# Altium project VCU.PrjPcb (part 2 of 2)

## Sheet 24V_Load_Switches.SchDoc
size A3; SheetNumber: 10; SheetTotal: 17
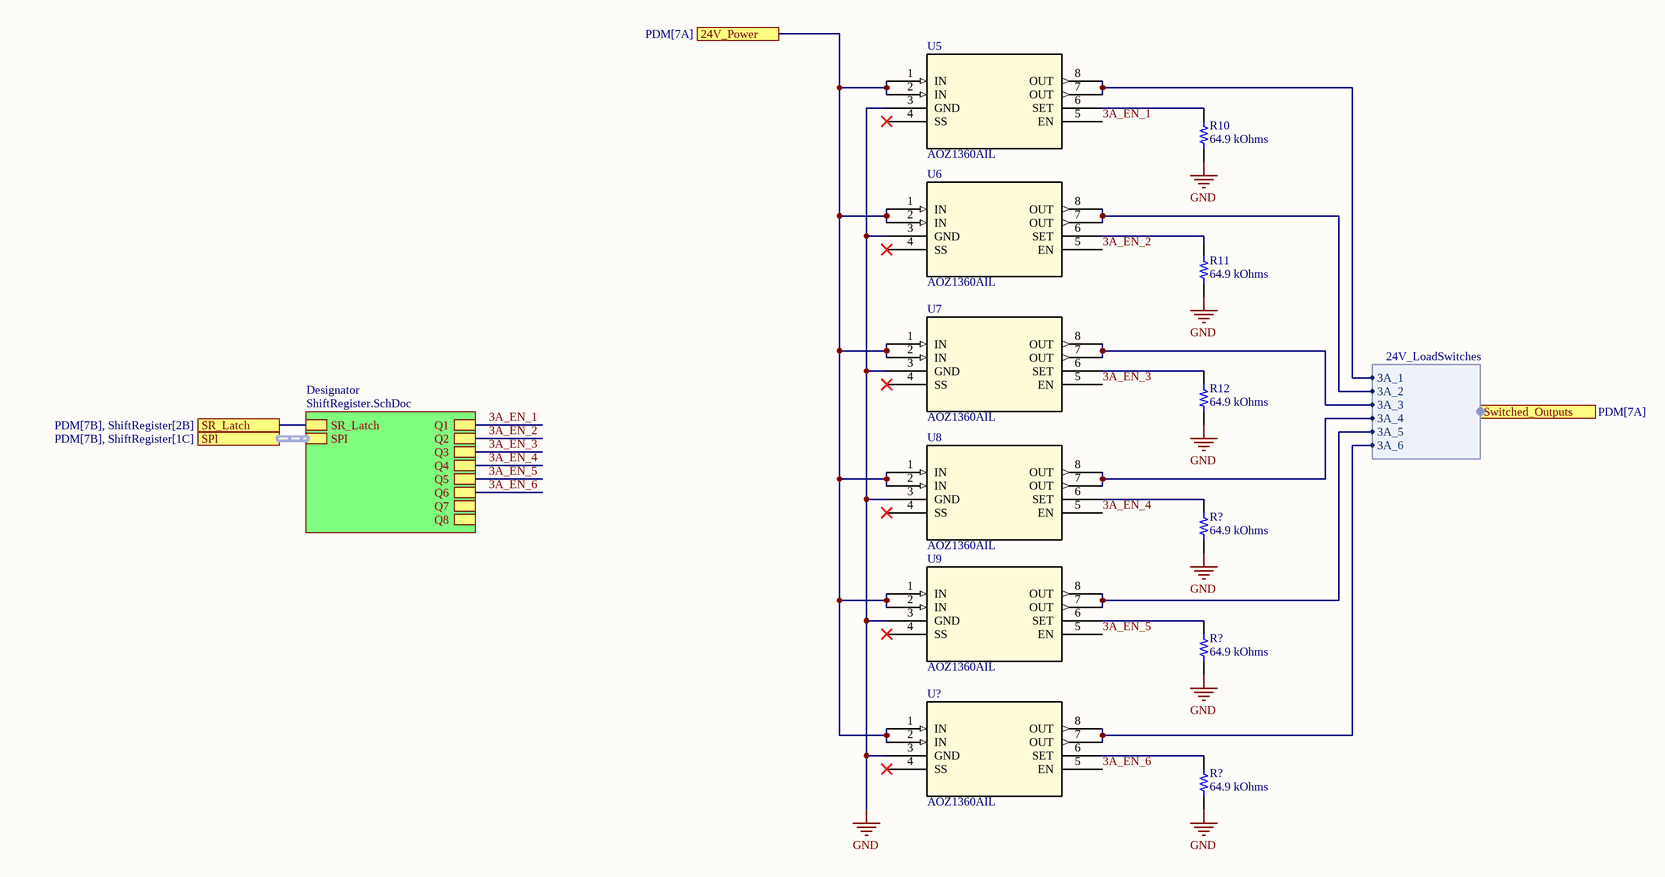
[diagram p8: 24V_Load_Switches.SchDoc]

### Parts
(Parts that share a designator on the sheet are numbered #1, #2 ... from top to bottom, then left to right.)
R10  64.9 kOhms  [RES 0603_1608]
R11  64.9 kOhms  [RES 0603_1608]
R12  64.9 kOhms  [RES 0603_1608]
R?#1  64.9 kOhms  [RES 0603_1608]
R?#2  64.9 kOhms  [RES 0603_1608]
R?#3  64.9 kOhms  [RES 0603_1608]
U5  AOZ1360AIL  [AOZ1360AIL_AOS]
U6  AOZ1360AIL  [AOZ1360AIL_AOS]
U7  AOZ1360AIL  [AOZ1360AIL_AOS]
U8  AOZ1360AIL  [AOZ1360AIL_AOS]
U9  AOZ1360AIL  [AOZ1360AIL_AOS]
U?#2  AOZ1360AIL  [AOZ1360AIL_AOS]

### Sub-sheets
Designator = ShiftRegister.SchDoc: SPI (harness SPI), SR_Latch, Q1, Q2, Q3, Q4, Q5, Q6, Q8, Q7

### Ports
24V_Power (see PDM[7A]), SPI (harness SPI, see PDM[7B], ShiftRegister[1C]), SR_Latch (see PDM[7B], ShiftRegister[2B]), Switched_Outputs (harness 24V_LoadSwitches, see PDM[7A])

### Harnesses
24V_LoadSwitches: 3A_1, 3A_2, 3A_3, 3A_4, 3A_5, 3A_6

### Nets
GND: R10.1 R11.1 R12.1 R?#1.1 R?#2.1 R?#3.1 U5.3(GND) U6.3(GND) U7.3(GND) U8.3(GND) U9.3(GND) U?#2.3(GND)
3A_EN_1: U5.5(EN) ; sheet Designator/Q1
3A_EN_2: U6.5(EN) ; sheet Designator/Q2
3A_EN_3: U7.5(EN) ; sheet Designator/Q3
3A_EN_4: U8.5(EN) ; sheet Designator/Q4
3A_EN_5: U9.5(EN) ; sheet Designator/Q5
3A_EN_6: U?#2.5(EN) ; sheet Designator/Q6
24V_3A_1: U5.7(OUT) U5.8(OUT) ; port Switched_Outputs.3A_1
24V_3A_2: U6.7(OUT) U6.8(OUT) ; port Switched_Outputs.3A_2
24V_3A_3: U7.7(OUT) U7.8(OUT) ; port Switched_Outputs.3A_3
24V_3A_4: U8.7(OUT) U8.8(OUT) ; port Switched_Outputs.3A_4
24V_3A_5: U9.7(OUT) U9.8(OUT) ; port Switched_Outputs.3A_5
24V_3A_6: U?#2.7(OUT) U?#2.8(OUT) ; port Switched_Outputs.3A_6
NetIC1_81: port SR_Latch, sheet Designator/SR_Latch
NetR10_2: R10.2 U5.6(SET)
NetR11_2: R11.2 U6.6(SET)
NetR12_2: R12.2 U7.6(SET)
NetR24_1: U5.1(IN) U5.2(IN) U6.1(IN) U6.2(IN) U7.1(IN) U7.2(IN) U8.1(IN) U8.2(IN) U9.1(IN) U9.2(IN) U?#2.1(IN) U?#2.2(IN) ; port 24V_Power
NetR?#1_2: R?#1.2 U8.6(SET)
NetR?#2_2: R?#2.2 U9.6(SET)
NetR?#3_2: R?#3.2 U?#2.6(SET)

Not connected (* = marked no-connect by the designer): U5 4(SS)*; U6 4(SS)*; U7 4(SS)*; U8 4(SS)*; U9 4(SS)*; U?#2 4(SS)*

### Buses and harness runs
harness port SPI = sheet Designator/SPI

### Library data of the parts
R10-R12 R?#1-R?#3 = 7-2176089-3: RES SMD 64.9K OHM 0.1% 1/6W 0603; Manufacturer: TE Connectivity Passive Product; Power (Watts): 0.167W, 1/6W; Temperature Coefficient: ±25ppm/°C; Part Number: 7-2176089-3; Value: 64.9 kOhms; ComponentLink1Description: Datasheet; ComponentLink1URL: https://www.te.com/commerce/DocumentDelivery/DDEController?Action=srchrtrv&DocNm=1773272&DocType=DS&DocLang=English; ComponentLink2Description: DigiKey Link; ComponentLink2URL: https://www.digikey.com/en/products/detail/te-connectivity-passive-product/7-2176089-3/4033750; Composition: Thin Film; Device Package: 0603 (1608 Metric); Height - Seated (Max): 0.022" (0.55mm); LastUpdated: 12/19/2023 8:39:23 PM; Lifecycle Status: Active; Minimum Order: 1; Number of Terminations: 2; Operating Temperature: -55°C ~ 155°C; Package / Case: 0603 (1608 Metric); Packaging: TapeAndReel; PartId: 23912; Part Status: Active; Price: 0.14; Resistance: 64.9 kOhms; Series: RP73P, Holsworthy; Size / Dimension: 0.061" L x 0.031" W (1.55mm x 0.80mm); Supplier 1: DigiKey; Supplier Part Number 1: A110282CT-ND; Supplier Device Package: 0603; Tolerance: ±0.1%
U5-U9 U?#2 = AOZ1360AIL: No Description Available; Mfr_Name: Alpha and Omega Semiconductor; Copyright: Copyright (C) 2023 Ultra Librarian. All rights reserved.; Manufacturer_Part_Number: AOZ1360AIL; RefDes: RefDes; Type: DEV

## Sheet ShiftRegister.SchDoc
size A4; SheetNumber: 10; SheetTotal: 10
Used 3 times, as channels Power Distribution Manager/24V Load Switches/Designator, Power Distribution Manager/Designator/Designator, Power Distribution Manager/Designator/Designator. Parts and nets are listed once, with the designators drawn on the sheet.
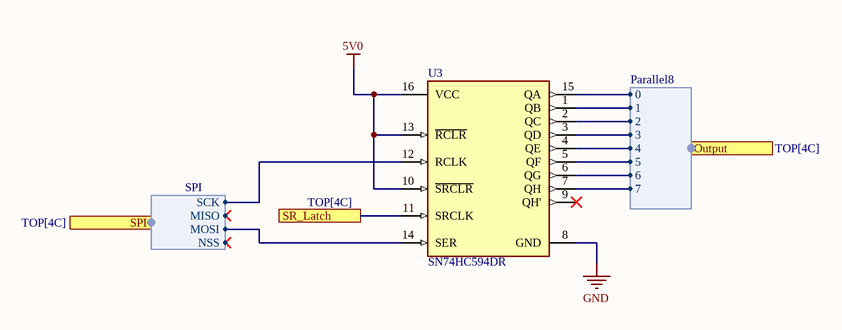
[diagram p9: ShiftRegister.SchDoc]

### Parts
U3  SN74HC594DR  [FP-D0016A-IPC_A]

### Ports
Output (harness Parallel8, see TOP[4C]), SPI (harness SPI, see TOP[4C]), SR_Latch (see TOP[4C])

### Harnesses
SPI: NSS, SCK, MISO, MOSI
Parallel8: 0, 1, 2, 3, 4, 5, 6, 7

### Nets
5V0: U3.10(~{SRCLR}) U3.13(~{RCLR}) U3.16(VCC)
GND: U3.8(GND)
SR_Latch: U3.11(SRCLK) ; port SR_Latch
NetU3_1: U3.1(QB) ; port Output.1
NetU3_2: U3.2(QC) ; port Output.2
NetU3_3: U3.3(QD) ; port Output.3
NetU3_4: U3.4(QE) ; port Output.4
NetU3_5: U3.5(QF) ; port Output.5
NetU3_6: U3.6(QG) ; port Output.6
NetU3_7: U3.7(QH) ; port Output.7
NetU3_12: U3.12(RCLK) ; port SPI.SCK
NetU3_14: U3.14(SER) ; port SPI.MOSI
NetU3_15: U3.15(QA) ; port Output.0

Not connected (* = marked no-connect by the designer): U3 9(QH')*

### Channels
Power Distribution Manager/24V Load Switches/Designator: designators end in _Power_Distribution_Manager_24V_Load_Switches_Designator; ports SR_Latch=NetIC1_81
Power Distribution Manager/Designator/Designator: designators end in _Power_Distribution_Manager_Designator_Designator#1; ports SR_Latch=NetIC1_82
Power Distribution Manager/Designator/Designator: designators end in _Power_Distribution_Manager_Designator_Designator#2; ports SR_Latch=NetU3_Power_Distribution_Manager_Designator_Designator#2_11

### Library data of the parts
U3 = CMP-0780-00061-4: IC SHIFT REGISTER 8BIT 16-SOIC; Number of Bits per Element: 8; Min Supply Voltage: 2V; Frequency: 40MHz; Max Supply Voltage: 6V; Operating Supply Voltage: 5V; Number of Output Lines: 10; Propagation Delay: 25ns; Number of Elements: 1; Number of Circuits: 4; Direction: Unidirectional; Turn-On Delay Time: 185ns; RoHS Compliant: Yes; Width: 3.91mm; Length: 9.9mm; Min Operating Temperature: -40°C; Max Operating Temperature: 125°C; Package Quantity: 2500; Series: 74HC; Height: 1.58mm; Number of Bits: 8; Mount: Surface Mount; Logic Function: Shift Register; Radiation Hardening: No; Number of Pins: 16; Technology: CMOS; Packaging: Tape and Reel; Lead Free: Lead Free; Weight: 0.004998oz; REACH SVHC: No SVHC; Case/Package: SOIC

## Sheet 12V_Load_Switches.SchDoc
size A3; SheetNumber: 16; SheetTotal: 17
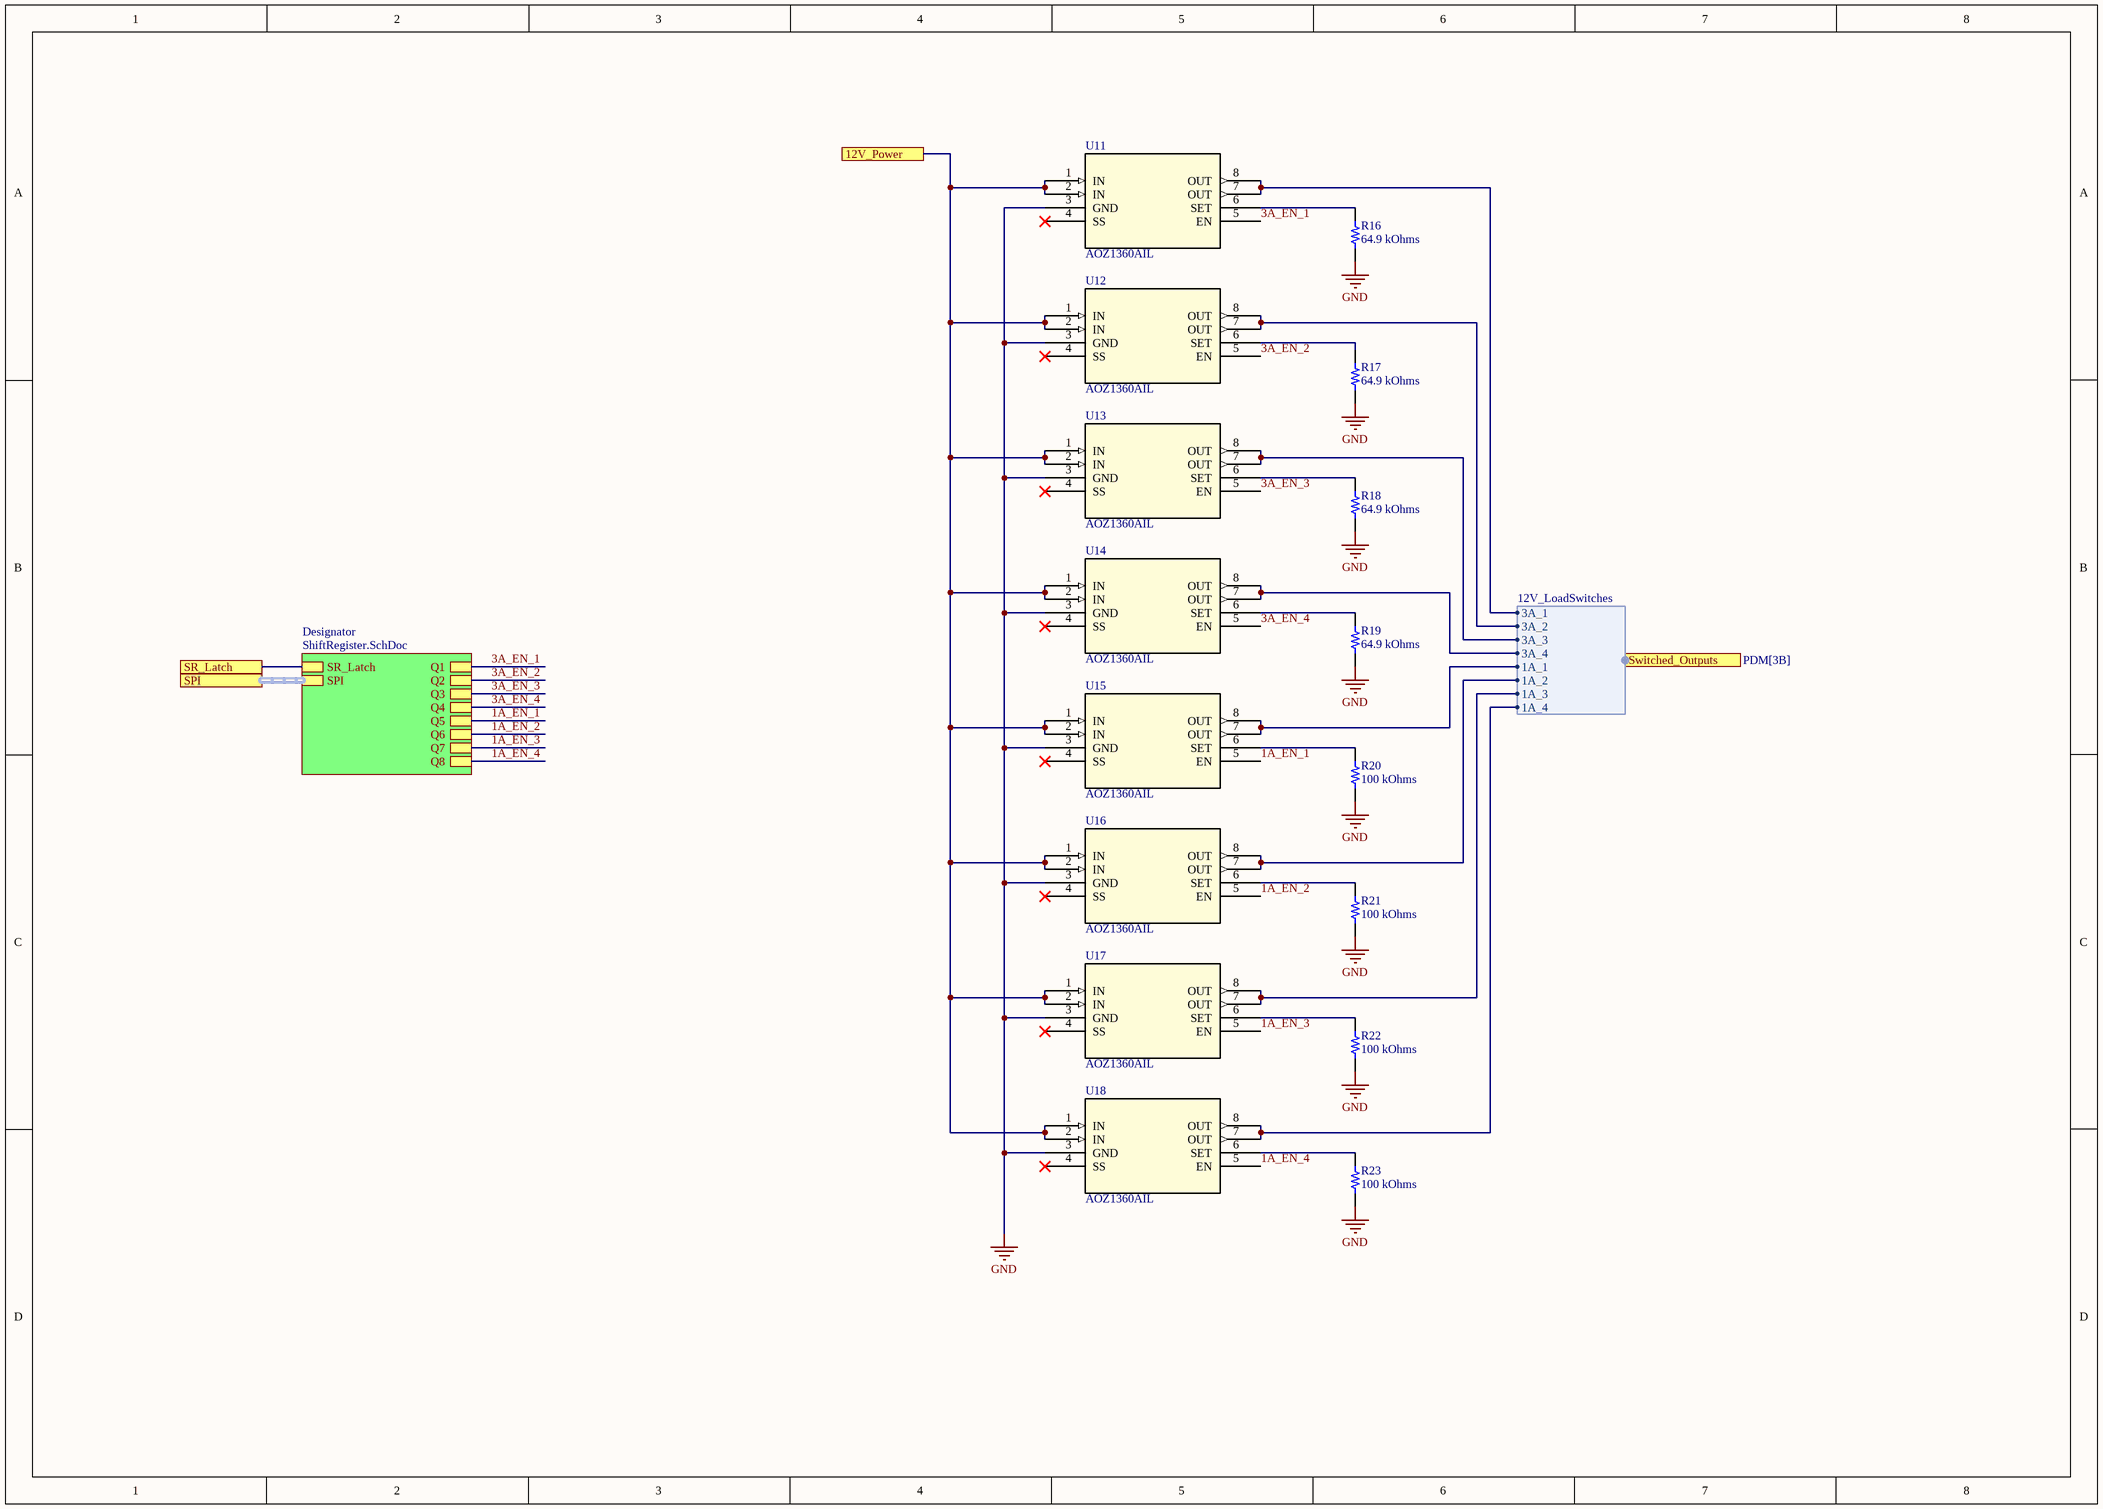
[diagram p10: 12V_Load_Switches.SchDoc]

### Parts
R16  64.9 kOhms  [RES 0603_1608]
R17  64.9 kOhms  [RES 0603_1608]
R18  64.9 kOhms  [RES 0603_1608]
R19  64.9 kOhms  [RES 0603_1608]
R20  100 kOhms  [RES 0603_1608]
R21  100 kOhms  [RES 0603_1608]
R22  100 kOhms  [RES 0603_1608]
R23  100 kOhms  [RES 0603_1608]
U11  AOZ1360AIL  [AOZ1360AIL_AOS]
U12  AOZ1360AIL  [AOZ1360AIL_AOS]
U13  AOZ1360AIL  [AOZ1360AIL_AOS]
U14  AOZ1360AIL  [AOZ1360AIL_AOS]
U15  AOZ1360AIL  [AOZ1360AIL_AOS]
U16  AOZ1360AIL  [AOZ1360AIL_AOS]
U17  AOZ1360AIL  [AOZ1360AIL_AOS]
U18  AOZ1360AIL  [AOZ1360AIL_AOS]

### Sub-sheets
Designator = ShiftRegister.SchDoc: SPI (harness SPI), SR_Latch, Q1, Q2, Q3, Q4, Q5, Q6, Q8, Q7

### Ports
12V_Power, SPI (harness SPI), SR_Latch, Switched_Outputs (harness 12V_LoadSwitches, see PDM[3B])

### Harnesses
12V_LoadSwitches: 3A_1, 3A_2, 3A_3, 3A_4, 1A_1, 1A_2, 1A_3, 1A_4

### Nets
GND: R16.1 R17.1 R18.1 R19.1 R20.1 R21.1 R22.1 R23.1 U11.3(GND) U12.3(GND) U13.3(GND) U14.3(GND) U15.3(GND) U16.3(GND) U17.3(GND) U18.3(GND)
1A_EN_1: U15.5(EN) ; sheet Designator/Q5
1A_EN_2: U16.5(EN) ; sheet Designator/Q6
1A_EN_3: U17.5(EN) ; sheet Designator/Q7
1A_EN_4: U18.5(EN) ; sheet Designator/Q8
3A_EN_1: U11.5(EN) ; sheet Designator/Q1
3A_EN_2: U12.5(EN) ; sheet Designator/Q2
3A_EN_3: U13.5(EN) ; sheet Designator/Q3
3A_EN_4: U14.5(EN) ; sheet Designator/Q4
12V_1A_1: U15.7(OUT) U15.8(OUT) ; port Switched_Outputs.1A_1
12V_1A_2: U16.7(OUT) U16.8(OUT) ; port Switched_Outputs.1A_2
12V_1A_3: U17.7(OUT) U17.8(OUT) ; port Switched_Outputs.1A_3
12V_1A_4: U18.7(OUT) U18.8(OUT) ; port Switched_Outputs.1A_4
12V_3A_1: U11.7(OUT) U11.8(OUT) ; port Switched_Outputs.3A_1
12V_3A_2: U12.7(OUT) U12.8(OUT) ; port Switched_Outputs.3A_2
12V_3A_3: U13.7(OUT) U13.8(OUT) ; port Switched_Outputs.3A_3
12V_3A_4: U14.7(OUT) U14.8(OUT) ; port Switched_Outputs.3A_4
NetIC1_82: port SR_Latch, sheet Designator/SR_Latch
NetR16_2: R16.2 U11.6(SET)
NetR17_2: R17.2 U12.6(SET)
NetR18_2: R18.2 U13.6(SET)
NetR19_2: R19.2 U14.6(SET)
NetR20_2: R20.2 U15.6(SET)
NetR21_2: R21.2 U16.6(SET)
NetR22_2: R22.2 U17.6(SET)
NetR23_2: R23.2 U18.6(SET)
NetR26_1: U11.1(IN) U11.2(IN) U12.1(IN) U12.2(IN) U13.1(IN) U13.2(IN) U14.1(IN) U14.2(IN) U15.1(IN) U15.2(IN) U16.1(IN) U16.2(IN) U17.1(IN) U17.2(IN) U18.1(IN) U18.2(IN) ; port 12V_Power

Not connected (* = marked no-connect by the designer): U11 4(SS)*; U12 4(SS)*; U13 4(SS)*; U14 4(SS)*; U15 4(SS)*; U16 4(SS)*; U17 4(SS)*; U18 4(SS)*

### Buses and harness runs
harness port SPI = sheet Designator/SPI

### Library data of the parts
R16-R19 = 7-2176089-3: as R10 on sheet 24V_Load_Switches; Part Number: 7-2176089-3; Value: 64.9 kOhms; ComponentLink1Description: Datasheet; ComponentLink1URL: https://www.te.com/commerce/DocumentDelivery/DDEController?Action=srchrtrv&DocNm=1773272&DocType=DS&DocLang=English; ComponentLink2Description: DigiKey Link; ComponentLink2URL: https://www.digikey.com/en/products/detail/te-connectivity-passive-product/7-2176089-3/4033750; Composition: Thin Film; Device Package: 0603 (1608 Metric); Height - Seated (Max): 0.022" (0.55mm); LastUpdated: 12/19/2023 8:39:23 PM; Lifecycle Status: Active; Minimum Order: 1; Number of Terminations: 2; Operating Temperature: -55°C ~ 155°C; Package / Case: 0603 (1608 Metric); Packaging: TapeAndReel; PartId: 23912; Part Status: Active; Price: 0.14; Resistance: 64.9 kOhms; Series: RP73P, Holsworthy; Size / Dimension: 0.061" L x 0.031" W (1.55mm x 0.80mm); Supplier 1: DigiKey; Supplier Part Number 1: A110282CT-ND; Supplier Device Package: 0603; Tolerance: ±0.1%
R20-R23 = AA0603FR-07100KL: RES SMD 100K OHM 1% 1/10W 0603; Manufacturer: Yageo; Power (Watts): 0.1W, 1/10W; Temperature Coefficient: ±150ppm/°C; Part Number: AA0603FR-07100KL; Value: 100 kOhms; ComponentLink1Description: Datasheet; ComponentLink1URL: https://www.yageo.com/upload/media/product/productsearch/datasheet/rchip/PYu-AA_51_RoHS_L_3.pdf; ComponentLink2Description: DigiKey Link; ComponentLink2URL: https://www.digikey.com/en/products/detail/yageo/AA0603FR-07100KL/5888687; Composition: Thick Film; Device Package: 0603 (1608 Metric); Features: Anti-Sulfur, Automotive AEC-Q200, Moisture Resistant; Height - Seated (Max): 0.022" (0.55mm); LastUpdated: 12/20/2023 8:36:28 PM; Lifecycle Status: Active; Minimum Order: 1; Number of Terminations: 2; Operating Temperature: -55°C ~ 155°C; Package / Case: 0603 (1608 Metric); Packaging: TapeAndReel; PartId: 78895; Price: 0.01; Ratings: AEC-Q200; Resistance: 100 kOhms; Series: AA; Size / Dimension: 0.063" L x 0.031" W (1.60mm x 0.80mm); Supplier 1: DigiKey; Supplier Part Number 1: 13-AA0603FR-07100KLCT-ND; Supplier Device Package: 0603; Tolerance: ±1%
U11-U18 = AOZ1360AIL: as U5 on sheet 24V_Load_Switches; Copyright: Copyright (C) 2023 Ultra Librarian. All rights reserved.; Manufacturer_Part_Number: AOZ1360AIL; RefDes: RefDes; Type: DEV

## Sheet 5V_Load_Switches.SchDoc
size A4; SheetNumber: 14; SheetTotal: 18
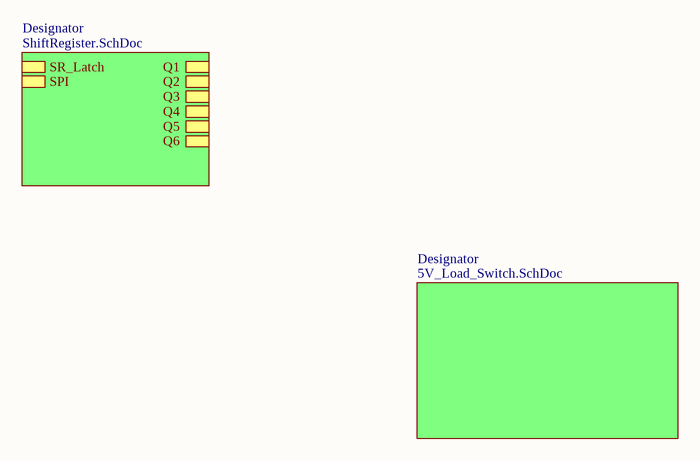
[diagram p11: 5V_Load_Switches.SchDoc]

### Sub-sheets
Designator = ShiftRegister.SchDoc: SPI (harness SPI), SR_Latch, Q1, Q2, Q3, Q4, Q5, Q6
Designator = 5V_Load_Switch.SchDoc (file not in this document): no entries

## Sheet 24V_FETS.SchDoc
size A4; SheetNumber: 12; SheetTotal: 14
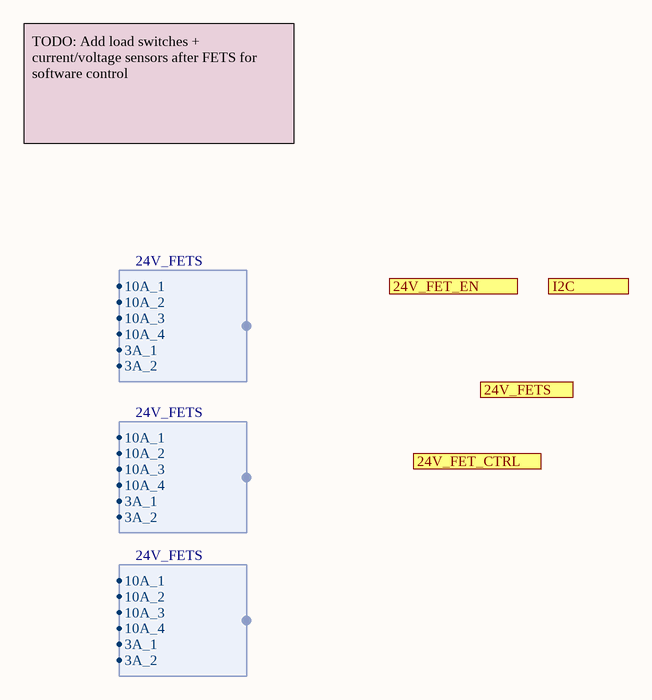
[diagram p12: 24V_FETS.SchDoc]

### Ports
24V_FET_CTRL (harness 24V_FETS), 24V_FET_EN (harness 24V_FETS), 24V_FETS (harness 24V_FETS), I2C (harness I2C)

### Harnesses
24V_FETS: 10A_1, 10A_2, 10A_3, 10A_4, 3A_1, 3A_2

### Notes on the sheet
- TODO: Add load switches + current/voltage sensors after FETS for software control

## Nets that join several sheets
5V0: Power Distribution Manager/24V Load Switches/Designator (U3_Power_Distribution_Manager_24V_Load_Switches_Designator.10 U3_Power_Distribution_Manager_24V_Load_Switches_Designator.13 U3_Power_Distribution_Manager_24V_Load_Switches_Designator.16), Power Distribution Manager/Designator/Designator (U3_Power_Distribution_Manager_Designator_Designator#1.10 U3_Power_Distribution_Manager_Designator_Designator#1.13 U3_Power_Distribution_Manager_Designator_Designator#1.16), Power Distribution Manager/Designator/Designator (U3_Power_Distribution_Manager_Designator_Designator#2.10 U3_Power_Distribution_Manager_Designator_Designator#2.13 U3_Power_Distribution_Manager_Designator_Designator#2.16)
5VCC: MCU (U?#1.3), IO (J22.1 J28.1)
GND: TOP (7 pins), MCU (26 pins), CAN (R4.1 R5.1 U1.2 U2.2), IO (42 pins), AnalogIO (10 pins), Ports/Analog Voltage Divs/Designator (R7_Ports_Analog_Voltage_Divs_Designator#1.1), Ports/Analog Voltage Divs/Designator (R7_Ports_Analog_Voltage_Divs_Designator#2.1), Ports/Analog Voltage Divs/Designator (R7_Ports_Analog_Voltage_Divs_Designator#3.1), Ports/Analog Voltage Divs/Designator (R7_Ports_Analog_Voltage_Divs_Designator#4.1), Ports/Analog Voltage Divs/Designator (R7_Ports_Analog_Voltage_Divs_Designator#5.1), Ports/Analog Voltage Divs/Designator (R7_Ports_Analog_Voltage_Divs_Designator#6.1), Ports/Analog Voltage Divs/Designator (R9_Ports_Analog_Voltage_Divs_Designator#1.1), Ports/Analog Voltage Divs/Designator (R9_Ports_Analog_Voltage_Divs_Designator#2.1), Ports/Analog Voltage Divs/Designator (R9_Ports_Analog_Voltage_Divs_Designator#3.1), Ports/Analog Voltage Divs/Designator (R9_Ports_Analog_Voltage_Divs_Designator#4.1), 24V_Load_Switches (12 pins), Power Distribution Manager/24V Load Switches/Designator (U3_Power_Distribution_Manager_24V_Load_Switches_Designator.8), 12V_Load_Switches (16 pins), Power Distribution Manager/Designator/Designator (U3_Power_Distribution_Manager_Designator_Designator#1.8), Power Distribution Manager/Designator/Designator (U3_Power_Distribution_Manager_Designator_Designator#2.8)
5V_MCU_SENSE: TOP (R28.2 R29.1), MCU (IC1.26)
12V_1A_1: IO (J7.1), 12V_Load_Switches (U15.7 U15.8)
12V_1A_2: IO (J12.1), 12V_Load_Switches (U16.7 U16.8)
12V_1A_3: IO (J19.1), 12V_Load_Switches (U17.7 U17.8)
12V_1A_4: IO (J24.1), 12V_Load_Switches (U18.7 U18.8)
12V_3A_1: IO (J6.1), 12V_Load_Switches (U11.7 U11.8)
12V_3A_2: IO (J11.1), 12V_Load_Switches (U12.7 U12.8)
12V_3A_3: IO (J18.1), 12V_Load_Switches (U13.7 U13.8)
12V_3A_4: IO (J23.1), 12V_Load_Switches (U14.7 U14.8)
12V_MCU_SENSE: TOP (R26.2 R27.1), MCU (IC1.25)
24V_3A_1: IO (J5.1 J51.1), 24V_Load_Switches (U5.7 U5.8)
24V_3A_2: IO (J10.1 J54.1), 24V_Load_Switches (U6.7 U6.8)
24V_3A_3: IO (J17.1), 24V_Load_Switches (U7.7 U7.8)
24V_3A_4: IO (J27.1), 24V_Load_Switches (U8.7 U8.8)
24V_3A_5: IO (J52.1), 24V_Load_Switches (U9.7 U9.8)
24V_3A_6: IO (J53.1), 24V_Load_Switches (U?#2.7 U?#2.8)
24V_MCU_SENSE: TOP (R24.2 R25.1), MCU (IC1.24)
A5V_1: IO (J31.1), Ports/Analog Voltage Divs/Designator (R8_Ports_Analog_Voltage_Divs_Designator#1.2)
A5V_2: IO (J31.2), Ports/Analog Voltage Divs/Designator (R8_Ports_Analog_Voltage_Divs_Designator#2.2)
A5V_3: IO (J31.3), Ports/Analog Voltage Divs/Designator (R8_Ports_Analog_Voltage_Divs_Designator#3.2)
A5V_4: IO (J31.4), Ports/Analog Voltage Divs/Designator (R8_Ports_Analog_Voltage_Divs_Designator#4.2)
A12V_1: IO (J30.1), Ports/Analog Voltage Divs/Designator (R6_Ports_Analog_Voltage_Divs_Designator#2.2)
A12V_2: IO (J30.2), Ports/Analog Voltage Divs/Designator (R6_Ports_Analog_Voltage_Divs_Designator#3.2)
A12V_3: IO (J30.3), Ports/Analog Voltage Divs/Designator (R6_Ports_Analog_Voltage_Divs_Designator#4.2)
A12V_4: IO (J30.4), Ports/Analog Voltage Divs/Designator (R6_Ports_Analog_Voltage_Divs_Designator#5.2)
A12V_5: IO (J30.5), Ports/Analog Voltage Divs/Designator (R6_Ports_Analog_Voltage_Divs_Designator#6.2)
A12V_6: IO (J30.6), Ports/Analog Voltage Divs/Designator (R6_Ports_Analog_Voltage_Divs_Designator#1.2)
ADC_IN6: MCU (IC1.31), AnalogIO (C16.1), Ports/Analog Voltage Divs/Designator (R8_Ports_Analog_Voltage_Divs_Designator#4.1 R9_Ports_Analog_Voltage_Divs_Designator#4.2)
ADC_IN7: MCU (IC1.32), AnalogIO (C17.1), Ports/Analog Voltage Divs/Designator (R8_Ports_Analog_Voltage_Divs_Designator#3.1 R9_Ports_Analog_Voltage_Divs_Designator#3.2)
ADC_IN8: MCU (IC1.35), AnalogIO (C18.1), Ports/Analog Voltage Divs/Designator (R8_Ports_Analog_Voltage_Divs_Designator#2.1 R9_Ports_Analog_Voltage_Divs_Designator#2.2)
ADC_IN9: MCU (IC1.36), AnalogIO (C19.1), Ports/Analog Voltage Divs/Designator (R8_Ports_Analog_Voltage_Divs_Designator#1.1 R9_Ports_Analog_Voltage_Divs_Designator#1.2)
ADC_IN10: MCU (IC1.15), AnalogIO (C20.1), Ports/Analog Voltage Divs/Designator (R6_Ports_Analog_Voltage_Divs_Designator#1.1 R7_Ports_Analog_Voltage_Divs_Designator#1.2)
ADC_IN11: MCU (IC1.16), AnalogIO (C21.1), Ports/Analog Voltage Divs/Designator (R6_Ports_Analog_Voltage_Divs_Designator#6.1 R7_Ports_Analog_Voltage_Divs_Designator#6.2)
ADC_IN12: MCU (IC1.17), AnalogIO (C22.1), Ports/Analog Voltage Divs/Designator (R6_Ports_Analog_Voltage_Divs_Designator#5.1 R7_Ports_Analog_Voltage_Divs_Designator#5.2)
ADC_IN13: MCU (IC1.18), AnalogIO (C23.1), Ports/Analog Voltage Divs/Designator (R6_Ports_Analog_Voltage_Divs_Designator#4.1 R7_Ports_Analog_Voltage_Divs_Designator#4.2)
ADC_IN14: MCU (IC1.33), AnalogIO (C24.1), Ports/Analog Voltage Divs/Designator (R6_Ports_Analog_Voltage_Divs_Designator#3.1 R7_Ports_Analog_Voltage_Divs_Designator#3.2)
ADC_IN15: MCU (IC1.34), AnalogIO (C25.1), Ports/Analog Voltage Divs/Designator (R6_Ports_Analog_Voltage_Divs_Designator#2.1 R7_Ports_Analog_Voltage_Divs_Designator#2.2)
CAN1.CANH: CAN (J1.2 J3.2 R2.1 U1.7), IO (6 pins)
CAN1.CANL: CAN (J1.1 J3.1 SW1.3 U1.6), IO (6 pins)
CAN2.CANH: CAN (J2.2 J4.2 R3.2 U2.7), IO (6 pins)
CAN2.CANL: CAN (J2.1 J4.1 SW1.4 U2.6), IO (6 pins)
NetIC1_43: MCU (IC1.43), Power Distribution Manager/24V Load Switches/Designator (U3_Power_Distribution_Manager_24V_Load_Switches_Designator.12), Power Distribution Manager/Designator/Designator (U3_Power_Distribution_Manager_Designator_Designator#1.12)
NetIC1_45: MCU (IC1.45), Power Distribution Manager/24V Load Switches/Designator (U3_Power_Distribution_Manager_24V_Load_Switches_Designator.14), Power Distribution Manager/Designator/Designator (U3_Power_Distribution_Manager_Designator_Designator#1.14)
NetIC1_55: TOP (J48.1), MCU (IC1.55)
NetIC1_56: TOP (J48.2), MCU (IC1.56)
NetIC1_68: TOP (J50.1), MCU (IC1.68)
NetIC1_69: TOP (J50.2), MCU (IC1.69)
NetIC1_70: MCU (IC1.70), CAN (U1.4)
NetIC1_71: MCU (IC1.71), CAN (U1.1)
NetIC1_78: TOP (J47.1), MCU (IC1.78)
NetIC1_79: TOP (J47.2), MCU (IC1.79)
NetIC1_81: MCU (IC1.81), Power Distribution Manager/24V Load Switches/Designator (U3_Power_Distribution_Manager_24V_Load_Switches_Designator.11)
NetIC1_82: MCU (IC1.82), Power Distribution Manager/Designator/Designator (U3_Power_Distribution_Manager_Designator_Designator#1.11)
NetIC1_86: TOP (J49.1), MCU (IC1.86)
NetIC1_87: TOP (J49.2), MCU (IC1.87)
NetIC1_91: MCU (IC1.91), CAN (U2.4)
NetIC1_92: MCU (IC1.92), CAN (U2.1)
NetR24_1: TOP (R24.1), 24V_Load_Switches (12 pins)
NetR26_1: TOP (R26.1), 12V_Load_Switches (16 pins)